# Altium project mainBoard.PrjPCB
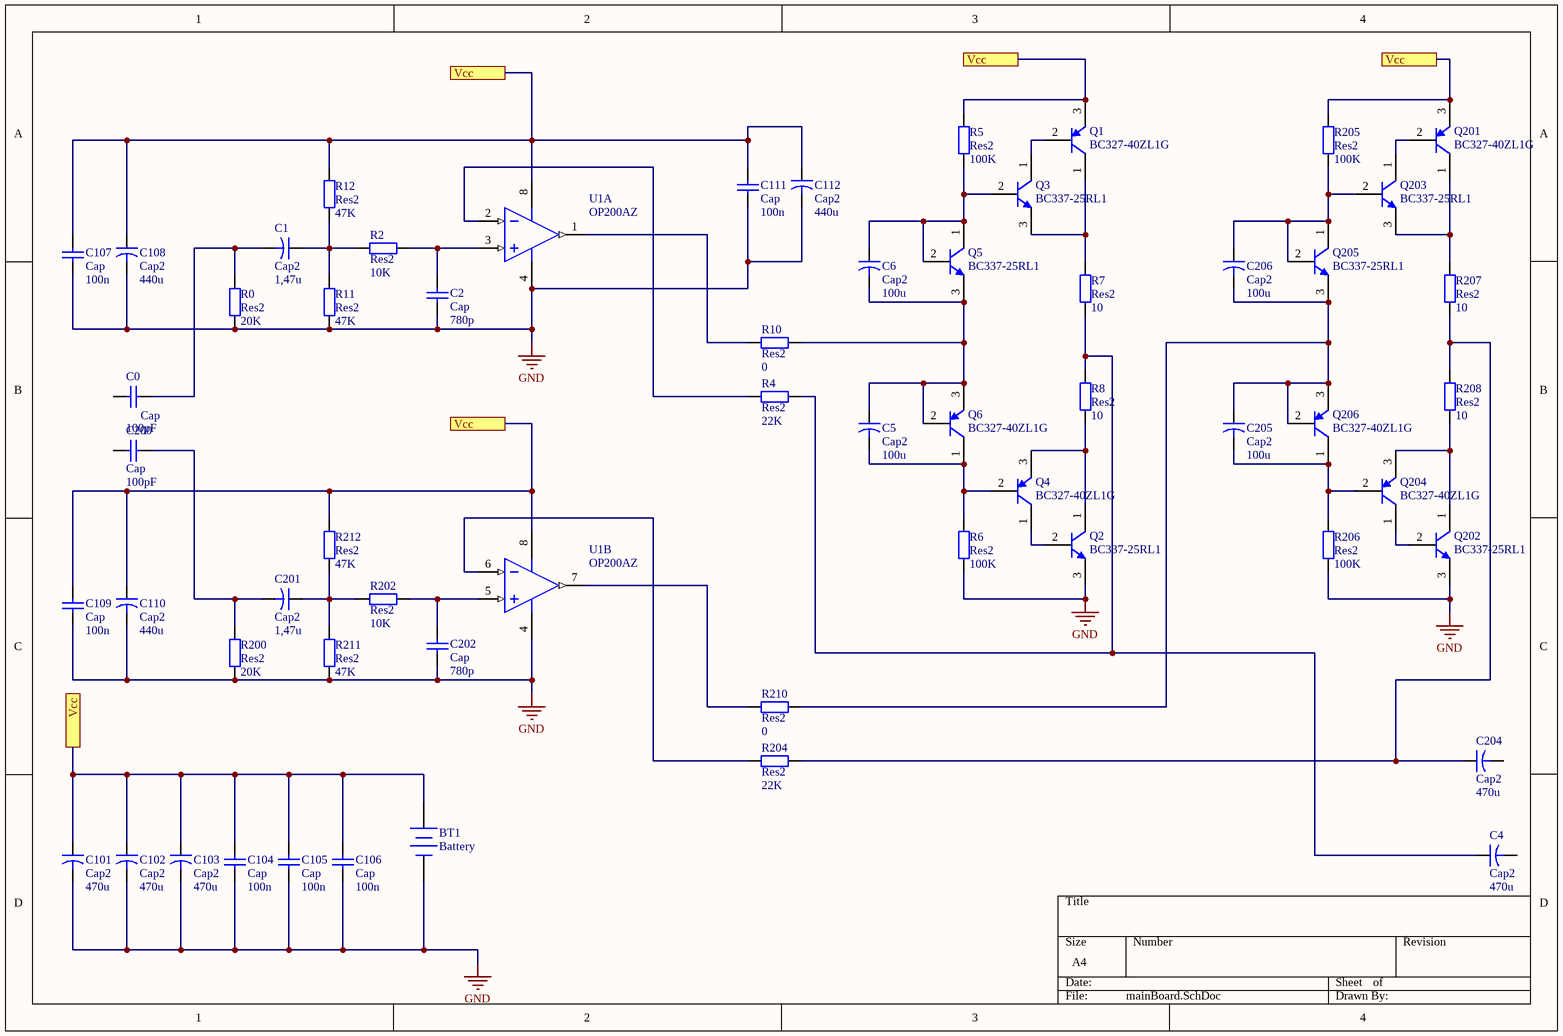
[diagram p0: mainBoard.SchDoc]
1 sheet, 58 parts. Net scope: flat (ports and power ports of the same name join across sheets).
Board file: PCB1.PcbDoc

## Sheet mainBoard.SchDoc
size A4

### Parts
BT1  Battery  [BAT-2]
C0  Cap  value 100pF  [RAD-0.3]
C1  Cap2  value 1,47u  [CAPR5-4X5]
C2  Cap  value 780p  [RAD-0.3]
C4  Cap2  value 470u  [CAPR5-4X5]
C5  Cap2  value 100u  [CAPR5-4X5]
C6  Cap2  value 100u  [CAPR5-4X5]
C101  Cap2  value 470u  [CAPR5-4X5]
C102  Cap2  value 470u  [CAPR5-4X5]
C103  Cap2  value 470u  [CAPR5-4X5]
C104  Cap  value 100n  [RAD-0.3]
C105  Cap  value 100n  [RAD-0.3]
C106  Cap  value 100n  [RAD-0.3]
C107  Cap  value 100n  [RAD-0.3]
C108  Cap2  value 440u  [CAPR5-4X5]
C109  Cap  value 100n  [RAD-0.3]
C110  Cap2  value 440u  [CAPR5-4X5]
C111  Cap  value 100n  [RAD-0.3]
C112  Cap2  value 440u  [CAPR5-4X5]
C200  Cap  value 100pF  [RAD-0.3]
C201  Cap2  value 1,47u  [CAPR5-4X5]
C202  Cap  value 780p  [RAD-0.3]
C204  Cap2  value 470u  [CAPR5-4X5]
C205  Cap2  value 100u  [CAPR5-4X5]
C206  Cap2  value 100u  [CAPR5-4X5]
Q1  BC327-40ZL1G  [ONSC-TO-92-3-29-11_AM_BL]
Q2  BC337-25RL1  [ONSC-TO-92-3-29-11_AM_BL]
Q3  BC337-25RL1  [ONSC-TO-92-3-29-11_AM_BL]
Q4  BC327-40ZL1G  [ONSC-TO-92-3-29-11_AM_BL]
Q5  BC337-25RL1  [ONSC-TO-92-3-29-11_AM_BL]
Q6  BC327-40ZL1G  [ONSC-TO-92-3-29-11_AM_BL]
Q201  BC327-40ZL1G  [ONSC-TO-92-3-29-11_AM_BL]
Q202  BC337-25RL1  [ONSC-TO-92-3-29-11_AM_BL]
Q203  BC337-25RL1  [ONSC-TO-92-3-29-11_AM_BL]
Q204  BC327-40ZL1G  [ONSC-TO-92-3-29-11_AM_BL]
Q205  BC337-25RL1  [ONSC-TO-92-3-29-11_AM_BL]
Q206  BC327-40ZL1G  [ONSC-TO-92-3-29-11_AM_BL]
R0  Res2  value 20K  [AXIAL-0.4]
R2  Res2  value 10K  [AXIAL-0.4]
R4  Res2  value 22K  [AXIAL-0.4]
R5  Res2  value 100K  [AXIAL-0.4]
R6  Res2  value 100K  [AXIAL-0.4]
R7  Res2  value 10  [AXIAL-0.4]
R8  Res2  value 10  [AXIAL-0.4]
R10  Res2  value 0  [AXIAL-0.4]
R11  Res2  value 47K  [AXIAL-0.4]
R12  Res2  value 47K  [AXIAL-0.4]
R200  Res2  value 20K  [AXIAL-0.4]
R202  Res2  value 10K  [AXIAL-0.4]
R204  Res2  value 22K  [AXIAL-0.4]
R205  Res2  value 100K  [AXIAL-0.4]
R206  Res2  value 100K  [AXIAL-0.4]
R207  Res2  value 10  [AXIAL-0.4]
R208  Res2  value 10  [AXIAL-0.4]
R210  Res2  value 0  [AXIAL-0.4]
R211  Res2  value 47K  [AXIAL-0.4]
R212  Res2  value 47K  [AXIAL-0.4]
U1  OP200AZ  [ADI-Q-8]  (parts A,B of 2)

### Ports
Vcc

### Nets
GND: BT1.2(-) C2.1 C101.2 C102.2 C103.2 C104.1 C105.1 C106.1 C107.1 C108.2 C109.1 C110.2 C111.1 C112.2 C202.1 Q2.3(E) Q202.3(E) R0.1 R6.1 R11.1 R200.1 R206.1 R211.1 U1.4(-V)
NetBT1_1: BT1.1(+) C101.1 C102.1 C103.1 C104.2 C105.2 C106.2 C107.2 C108.1 C109.2 C110.1 C111.2 C112.1 Q1.3(E) Q201.3(E) R5.2 R12.2 R205.2 R212.2 U1.8(+V) ; port Vcc
NetC0_1: C0.1 C1.2 R0.2
NetC1_1: C1.1 R2.2 R11.2 R12.1
NetC2_2: C2.2 R2.1 U1.3(+IN_A)
NetC4_1: C4.1 R4.1 R7.1 R8.2
NetC5_1: C5.1 C6.2 Q5.3(E) Q6.2(B) Q6.3(E) R10.1
NetC5_2: C5.2 Q4.2(B) Q6.1(C) R6.2
NetC6_1: C6.1 Q3.2(B) Q5.1(C) Q5.2(B) R5.1
NetC200_1: C200.1 C201.2 R200.2
NetC201_1: C201.1 R202.2 R211.2 R212.1
NetC202_2: C202.2 R202.1 U1.5(+IN_B)
NetC204_1: C204.1 R204.1 R207.1 R208.2
NetC205_1: C205.1 C206.2 Q205.3(E) Q206.2(B) Q206.3(E) R210.1
NetC205_2: C205.2 Q204.2(B) Q206.1(C) R206.2
NetC206_1: C206.1 Q203.2(B) Q205.1(C) Q205.2(B) R205.1
NetQ1_1: Q1.1(C) Q3.3(E) R7.2
NetQ1_2: Q1.2(B) Q3.1(C)
NetQ2_1: Q2.1(C) Q4.3(E) R8.1
NetQ2_2: Q2.2(B) Q4.1(C)
NetQ201_1: Q201.1(C) Q203.3(E) R207.2
NetQ201_2: Q201.2(B) Q203.1(C)
NetQ202_1: Q202.1(C) Q204.3(E) R208.1
NetQ202_2: Q202.2(B) Q204.1(C)
NetR4_2: R4.2 U1.2(-IN_A)
NetR10_2: R10.2 U1.1(OUT_A)
NetR204_2: R204.2 U1.6(-IN_B)
NetR210_2: R210.2 U1.7(OUT_B)

Not connected (* = marked no-connect by the designer): C0 2; C4 2; C200 2; C204 2

### Library data of the parts
BT1 = Battery: Multicell Battery; Published: 24-Mar-1999; LatestRevisionDate: 17-Jul-2002; LatestRevisionNote: Re-released for DXP Platform.; PackageReference: BAT-2; Publisher: Altium Limited; PackageDescription: Battery; 2 Leads
C0 C2 C104-C107 C109 C111 C200 C202 = Cap: Capacitor; Published: 8-Jun-2000; LatestRevisionDate: 17-Jul-2002; LatestRevisionNote: Re-released for DXP Platform.; PackageReference: RAD-0.3; Publisher: Altium Limited; PackageDescription: Radial Cap, Thru-Hole; 2 Leads; 0.3 in Pin Spacing
C1 C4-C6 C101-C103 C108 C110 C112 C201 C204-C206 = Cap2: Capacitor; Published: 23-Sep-2002; PackageReference: CAPR5-4X5; Publisher: Altium Limited; PackageDescription: Capacitor; 2 Leads
Q1 Q4 Q6 Q201 Q204 Q206 = BC327-40ZL1G: Amplifier Transistor, PNP Silicon, 3-Pin TO-92, Pb-Free, Ammo Box; Manufacturer: On Semiconductor; IC Continuous (A): -0.8; DatasheetVersion: Rev. 6; PackageVersion: Rev. AM; PackageReference: TO-92-3-29-11_AM_BL; PackageDescription: 3-Pin Transistor Outline, Body 4.825 x 3.685 mm, Pitch 1.27 mm; Supplier 1: Digi-Key; Supplier Part Number 1: BC327-40ZL1GOSTB-ND; Supplier 2: Digi-Key; Supplier Part Number 2: BC327-40ZL1GOSCT-ND; Supplier 3: Farnell; Supplier Part Number 3: 2317541; Supplier 4: Farnell; Supplier Part Number 4: 2322378; Supplier 5: Newark; Supplier Part Number 5: 26K3394; Supplier 6: Mouser; Supplier Part Number 6: 863-BC327-40ZL1G; Packing: Ammo Box; Polarity: PNP; RoHS: TRUE; Mounting Technology: Through Hole; PartNumber: BC327-40ZL1G; ComponentLink1Description: Manufacturer URL; ComponentLink1URL: http://www.onsemi.com/; ComponentLink2Description: Datasheet; ComponentLink2URL: http://www.onsemi.com/pub_link/Collateral/BC327-D.PDF; ComponentLink3Description: Package Specification; ComponentLink3URL: http://www.onsemi.com/pub_link/Collateral/MAC97-D.PDF
Q2 Q3 Q5 Q202 Q203 Q205 = BC337-25RL1: Amplifier Transistor, NPN Silicon, 3-Pin TO-92, Tape and Reel; Manufacturer: On Semiconductor; Note: 0; IC Continuous (A): 0.8; DatasheetVersion: Rev. 8; PackageVersion: Rev. AM; PackageReference: TO-92-3-29-11_AM_BL; PackageDescription: 3-Pin Transistor Outline, Body 4.825 x 3.685 mm, Pitch 1.27 mm; Packing: Tape and Reel; Polarity: NPN; RoHS: FALSE; Mounting Technology: Through Hole; PartNumber: BC337-25RL1; ComponentLink1Description: Manufacturer URL; ComponentLink1URL: http://www.onsemi.com/; ComponentLink2Description: Datasheet; ComponentLink2URL: http://www.onsemi.com/pub_link/Collateral/BC337-D.PDF; ComponentLink3Description: Package Specification; ComponentLink3URL: http://www.onsemi.com/pub_link/Collateral/MAC97-D.PDF
R0 R2 R4-R8 R10-R12 R200 R202 R204-R208 R210-R212 = Res2: Resistor; Published: 8-Jun-2000; LatestRevisionDate: 17-Jul-2002; LatestRevisionNote: Re-released for DXP Platform.; PackageReference: AXIAL-0.4; Publisher: Altium Limited; PackageDescription: Axial Device, Thru-Hole; 2 Leads; 0.4 in Pin Spacing
U1 = OP200AZ: Double Channel Low Supply Current Operational Amplifier, 500 KHz BW, 150 mV/us SR, Military, 8-pin DIP (Q-8), Tube; Generic Part Number: OP200; Manufacturer: Analog Devices; Amplifiers Per Package: 2; Input Bias Current: 100pA; Input Offset Voltage: 80uV; Iq/Amp: 775uA; Small Signal Bandwidth: 500KHz; V Span Max: 40V; V Span Min: 6V; DatasheetVersion: Rev. E; PackageReference: Q-8; PackageDescription: 8-Pin Ceramic Dual In-Line Package, Row spacing 7.62 mm, Pitch 2.54 mm; Supplier 1: Digi-Key; Supplier Part Number 1: OP200AZ-ND; Supplier 2: Newark; Supplier Part Number 2: 05F8550; Packing: Tube; Slew Rate: 150mV/us; Mounting Technology: Through Hole; PartNumber: OP200AZ; ComponentLink1Description: Manufacturer URL; ComponentLink1URL: http://www.analog.com/en/index.html; ComponentLink2Description: Datasheet; ComponentLink2URL: http://www.analog.com/static/imported-files/data_sheets/OP200.pdf; ComponentLink3Description: Package Specification; ComponentLink3URL: http://www.analog.com/static/imported-files/packages/3925655241313314758Q_8.pdf